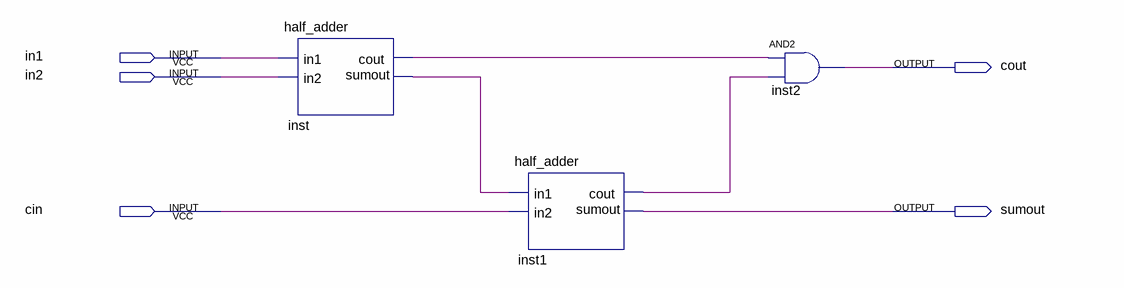
[diagram p0: schematic sheet]
// Quartus schematic full_adder.bdf as structural Verilog: 3 symbols, 5 pins
module full_adder (
  input  in1,
  input  in2,
  input  cin,
  output cout,
  output sumout
);

  wire inst1_cout, inst_cout, inst_sumout;

  half_adder inst (.in1(in1), .in2(in2), .sumout(inst_sumout), .cout(inst_cout));
  half_adder inst1 (.in1(inst_sumout), .in2(cin), .sumout(sumout), .cout(inst1_cout));
  and inst2 (cout, inst_cout, inst1_cout);
endmodule
